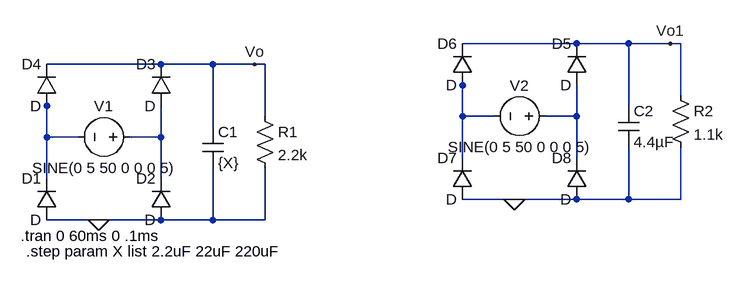
[diagram p0: schematic Versuch5_b.asc]
Versuch5_b.asc, the LTspice schematic file:
Version 4
SHEET 1 1028 680
WIRE 800 48 624 48
WIRE 880 48 800 48
WIRE 944 48 880 48
WIRE 960 48 944 48
WIRE 160 80 -16 80
WIRE 240 80 160 80
WIRE 304 80 240 80
WIRE 320 80 304 80
WIRE 624 112 624 96
WIRE 960 128 960 48
WIRE -16 144 -16 128
WIRE 880 144 880 48
WIRE 320 160 320 80
WIRE 624 160 624 112
WIRE 672 160 624 160
WIRE 800 160 800 112
WIRE 800 160 752 160
WIRE 240 176 240 80
WIRE -16 192 -16 144
WIRE 32 192 -16 192
WIRE 160 192 160 144
WIRE 160 192 112 192
WIRE 624 224 624 160
WIRE 800 224 800 160
WIRE -16 256 -16 192
WIRE 160 256 160 192
WIRE 704 288 624 288
WIRE 800 288 704 288
WIRE 880 288 880 208
WIRE 880 288 800 288
WIRE 960 288 960 208
WIRE 960 288 880 288
WIRE 64 320 -16 320
WIRE 160 320 64 320
WIRE 240 320 240 240
WIRE 240 320 160 320
WIRE 320 320 320 240
WIRE 320 320 240 320
FLAG 64 320 0
FLAG 304 80 Vo
FLAG 704 288 0
FLAG 944 48 Vo1
SYMBOL diode 176 144 R180
WINDOW 0 24 64 Left 2
WINDOW 3 24 0 Left 2
SYMATTR InstName D3
SYMBOL voltage 128 192 R90
WINDOW 0 -32 56 VBottom 2
WINDOW 3 32 56 VTop 2
WINDOW 123 0 0 Left 0
WINDOW 39 0 0 Left 0
SYMATTR InstName V1
SYMATTR Value SINE(0 5 50 0 0 0 5)
SYMBOL diode 0 144 R180
WINDOW 0 24 64 Left 2
WINDOW 3 24 0 Left 2
SYMATTR InstName D4
SYMBOL diode 0 320 R180
WINDOW 0 24 64 Left 2
WINDOW 3 24 0 Left 2
SYMATTR InstName D1
SYMBOL diode 176 320 R180
WINDOW 0 24 64 Left 2
WINDOW 3 24 0 Left 2
SYMATTR InstName D2
SYMBOL res 304 144 R0
SYMATTR InstName R1
SYMATTR Value 2.2k
SYMBOL cap 224 176 R0
SYMATTR InstName C1
SYMATTR Value {X}
SYMBOL diode 816 112 R180
WINDOW 0 24 64 Left 2
WINDOW 3 24 0 Left 2
SYMATTR InstName D5
SYMBOL voltage 768 160 R90
WINDOW 0 -32 56 VBottom 2
WINDOW 3 32 56 VTop 2
WINDOW 123 0 0 Left 0
WINDOW 39 0 0 Left 0
SYMATTR InstName V2
SYMATTR Value SINE(0 5 50 0 0 0 5)
SYMBOL diode 640 112 R180
WINDOW 0 24 64 Left 2
WINDOW 3 24 0 Left 2
SYMATTR InstName D6
SYMBOL diode 640 288 R180
WINDOW 0 24 64 Left 2
WINDOW 3 24 0 Left 2
SYMATTR InstName D7
SYMBOL diode 816 288 R180
WINDOW 0 24 64 Left 2
WINDOW 3 24 0 Left 2
SYMATTR InstName D8
SYMBOL res 944 112 R0
SYMATTR InstName R2
SYMATTR Value 1.1k
SYMBOL cap 864 144 R0
SYMATTR InstName C2
SYMATTR Value 4.4µF
TEXT -56 344 Left 2 !.tran 0 60ms 0 .1ms
TEXT -48 368 Left 2 !.step param X list 2.2uF 22uF 220uF

The netlist it stands for:
* Versuch5_b.asc
D3 N004 Vo D
V1 N004 N002 SINE(0 5 50 0 0 0 5)
D4 N002 Vo D
D1 0 N002 D
D2 0 N004 D
R1 Vo 0 2.2k
C1 Vo 0 {X}
D5 N003 Vo1 D
V2 N003 N001 SINE(0 5 50 0 0 0 5)
D6 N001 Vo1 D
D7 0 N001 D
D8 0 N003 D
R2 Vo1 0 1.1k
C2 Vo1 0 4.4µF
.model D D
.lib standard.dio
.tran 0 60ms 0 .1ms
.step param X list 2.2uF 22uF 220uF
.backanno
.end